# EAGLE schematic chaprshield (EAGLE 6.4)
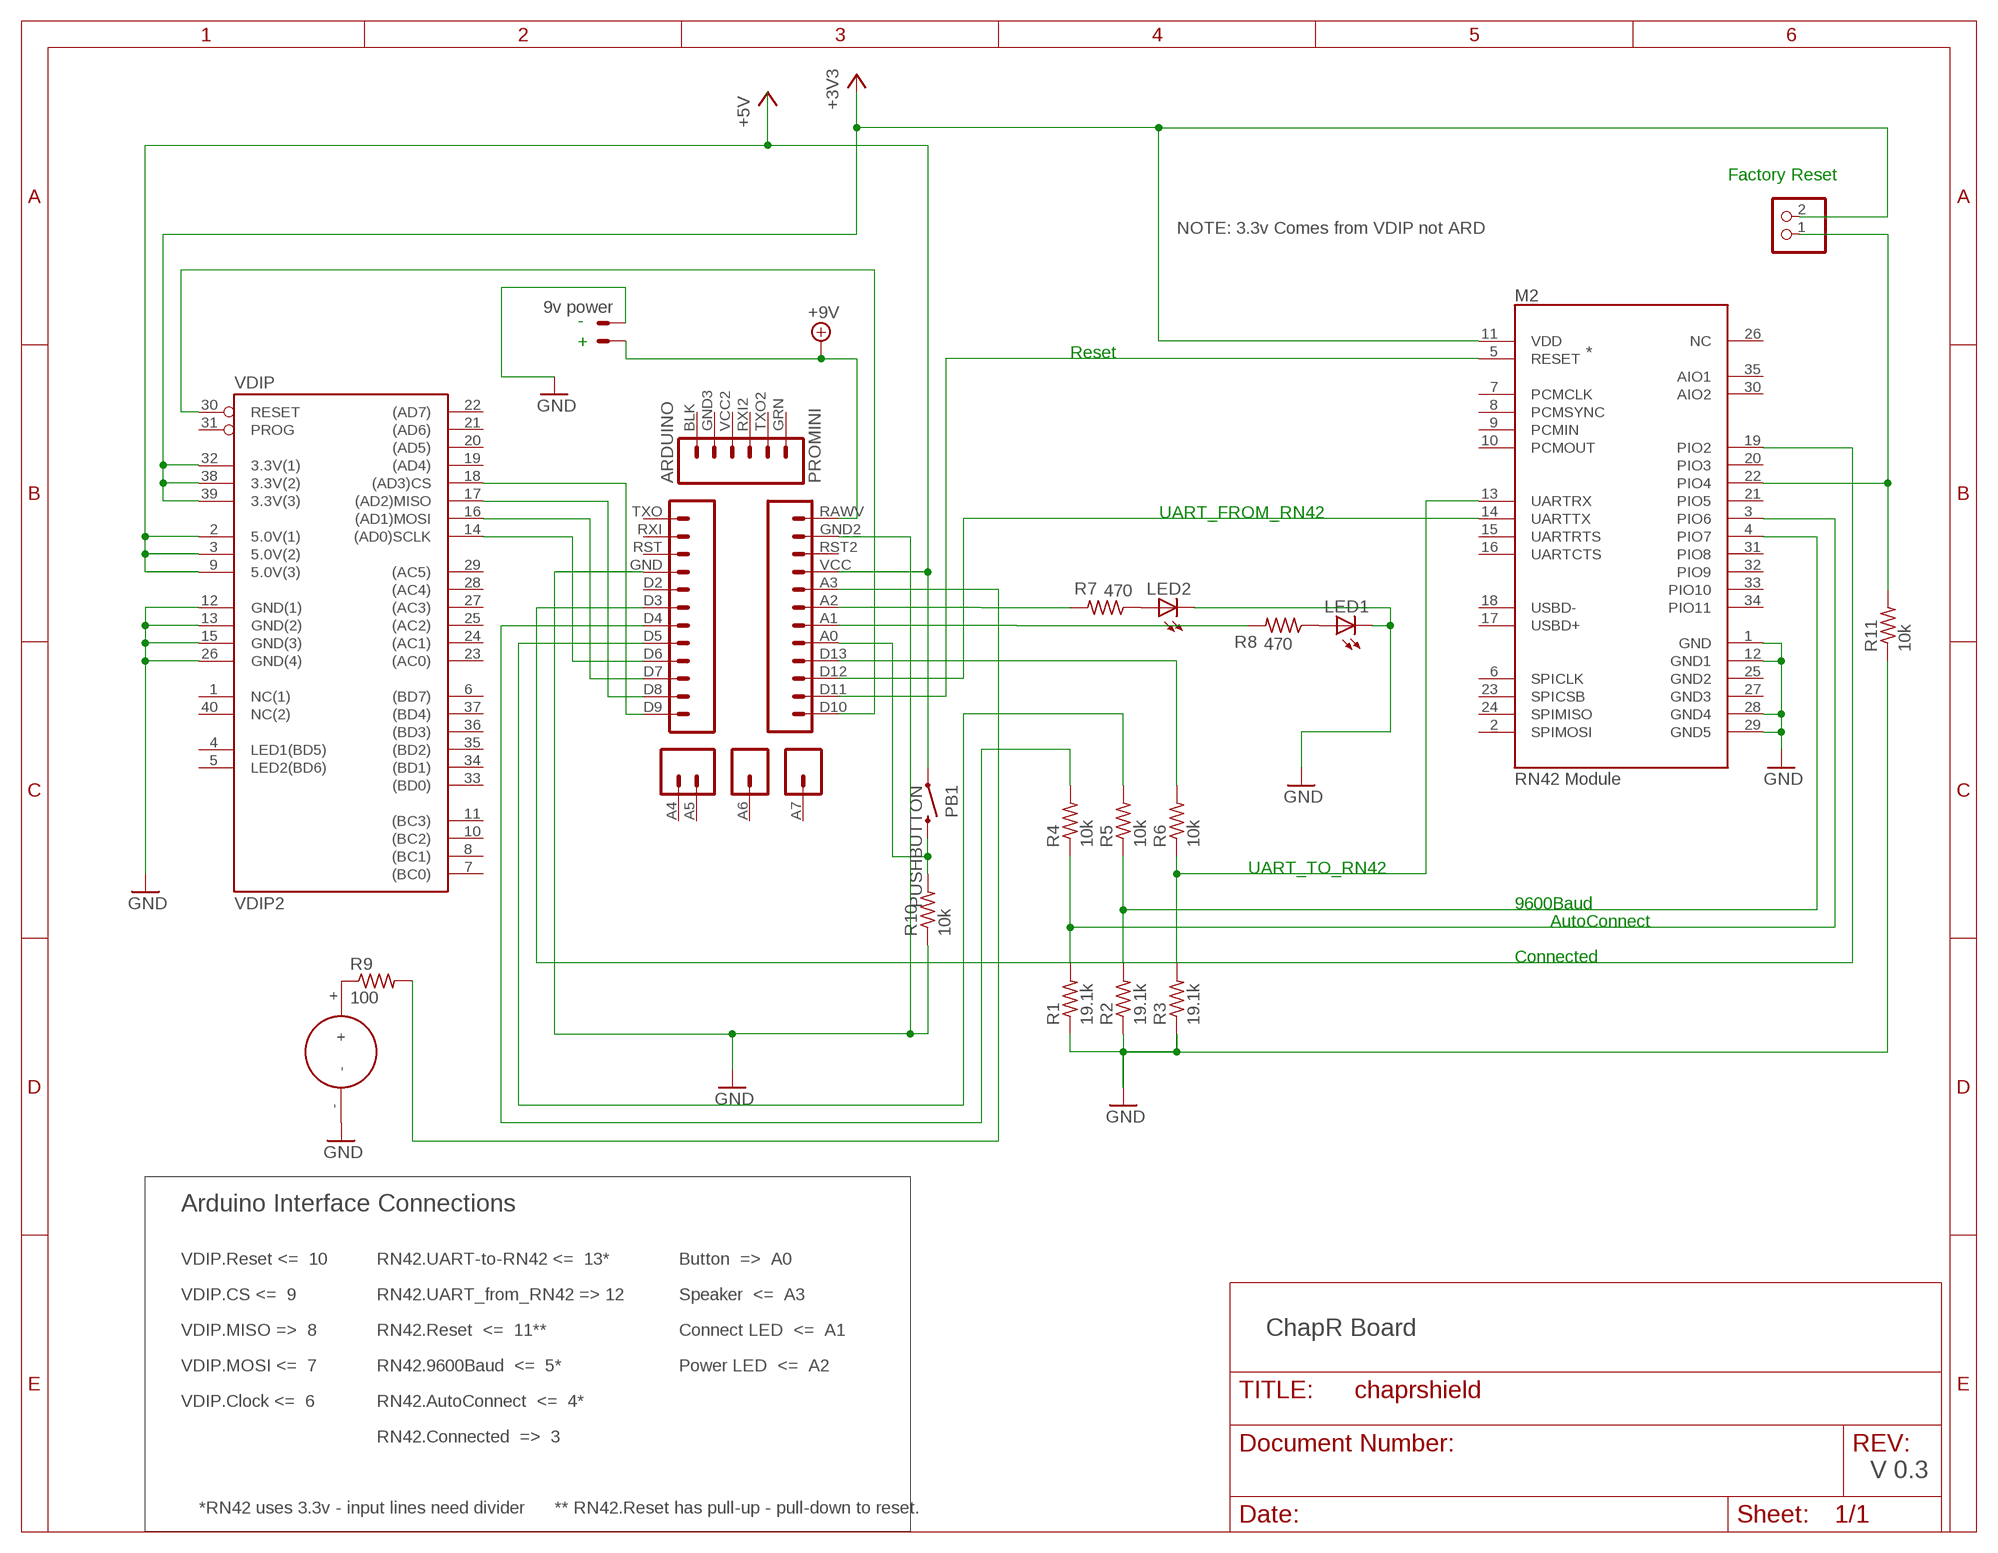
[diagram p0: schematic, sheet 1]

## Parts
-  9v power  22-23-2021  [22-23-2021]
ARDUINO  PROMINI  [PROMINI]
JP1  PINHD-1X2  [1X02]
LED1  LED3MM  [LED3MM]
LED2  LED3MM  [LED3MM]
M2  RN42 Module  BLUETOOTH-RN41"  [RN41]
PB1  PUSHBUTTON  [2-PIN-PUSHBUTTON]
R1  19.1k  R-US_0207/10  [0207/10]
R2  19.1k  R-US_0207/10  [0207/10]
R3  19.1k  R-US_0207/10  [0207/10]
R4  10k  R-US_0207/10  [0207/10]
R5  10k  R-US_0207/10  [0207/10]
R6  10k  R-US_0207/10  [0207/10]
R7  470  R-US_0207/10  [0207/10]
R8  470  R-US_0207/10  [0207/10]
R9  100  R-US_0207/10  [0207/10]
R10  10k  R-US_0207/10  [0207/10]
R11  10k  R-US_0207/10  [0207/10]
U$2  SPEAKER  [SPEAKER]
VDIP  VDIP2  [VDIP2]

## Nets
3.3V [GND]: JP1.2 M2.11(VDD) VDIP.32(3.3V(1)) VDIP.38(3.3V(2)) VDIP.39(3.3V(3))
+9V [GND]: -.2 ARDUINO.RAWV
GND [GND]: -.1 ARDUINO.GND ARDUINO.GND2 LED1.K(C) LED2.K(C) M2.1(GND) M2.12(GND1) M2.28(GND4) M2.29(GND5) R1.1 R2.1 R3.1 R10.1 R11.1 U$2.- VDIP.12(GND(1)) VDIP.13(GND(2)) VDIP.15(GND(3)) VDIP.26(GND(4))
N$1: ARDUINO.VCC PB1.P$1 VDIP.2(5.0V(1)) VDIP.3(5.0V(2)) VDIP.9(5.0V(3))
N$2: ARDUINO.D10 VDIP.30(RESET)
N$3: ARDUINO.D13 R6.2
N$4: ARDUINO.D12 M2.14(UARTTX)
N$5: ARDUINO.D11 M2.5(RESET)
N$6: M2.3(PIO6) R1.2 R4.1
N$7: M2.4(PIO7) R2.2 R5.1
N$8: ARDUINO.D5 R5.2
N$9: M2.13(UARTRX) R3.2 R6.1
N$10: ARDUINO.D9 VDIP.18((AD3)CS)
N$11: ARDUINO.D8 VDIP.17((AD2)MISO)
N$12: ARDUINO.D7 VDIP.16((AD1)MOSI)
N$13: ARDUINO.D6 VDIP.14((AD0)SCLK)
N$14: ARDUINO.D4 R4.2
N$15: ARDUINO.D3 M2.19(PIO2)
N$16: LED2.A R7.1
N$17: LED1.A R8.1
N$18: ARDUINO.A2 R7.2
N$19: R9.1 U$2.+
N$20: ARDUINO.A1 R8.2
N$21: ARDUINO.A3 R9.2
N$22: JP1.1 M2.22(PIO4) R11.2
N$24: ARDUINO.A0 PB1.P$2 R10.2
Unconnected: ARDUINO.A4 ARDUINO.A5 ARDUINO.A6 ARDUINO.A7 ARDUINO.BLK ARDUINO.D2 ARDUINO.GND3 ARDUINO.GRN ARDUINO.RST ARDUINO.RST2 ARDUINO.RXI ARDUINO.RXI2 ARDUINO.TXO ARDUINO.TXO2 ARDUINO.VCC2 M2.2(SPIMOSI) M2.6(SPICLK) M2.7(PCMCLK) M2.8(PCMSYNC) M2.9(PCMIN) M2.10(PCMOUT) M2.15(UARTRTS) M2.16(UARTCTS) M2.17(USBD+) M2.18(USBD-) M2.20(PIO3) M2.21(PIO5) M2.23(SPICSB) M2.24(SPIMISO) M2.25(GND2) M2.26(NC) M2.27(GND3) M2.30(AIO2) M2.31(PIO8) M2.32(PIO9) M2.33(PIO10) M2.34(PIO11) M2.35(AIO1) VDIP.6((BD7)) VDIP.7((BC0)) VDIP.8((BC1)) VDIP.10((BC2)) VDIP.11((BC3)) VDIP.19((AD4)) VDIP.20((AD5)) VDIP.21((AD6)) VDIP.22((AD7)) VDIP.23((AC0)) VDIP.24((AC1)) VDIP.25((AC2)) VDIP.27((AC3)) VDIP.28((AC4)) VDIP.29((AC5)) VDIP.31(PROG) VDIP.33((BD0)) VDIP.34((BD1)) VDIP.35((BD2)) VDIP.36((BD3)) VDIP.37((BD4))

## Notes on the sheet
- Factory Reset
- NOTE: 3.3v Comes from VDIP not ARD
- -
- +
- Reset | *
- UART_FROM_RN42
- UART_TO_RN42
- 9600Baud
- AutoConnect
- Connected
- Arduino Interface Connections
- VDIP.Reset <=  10 | RN42.UART-to-RN42 <=  13* | Button  =>  A0
- VDIP.CS <=  9 | RN42.UART_from_RN42 => 12 | Speaker  <=  A3
- VDIP.MISO =>  8 | RN42.Reset  <=  11** | Connect LED  <=  A1 | ChapR Board
- VDIP.MOSI <=  7 | RN42.9600Baud  <=  5* | Power LED  <=  A2
- VDIP.Clock <=  6 | RN42.AutoConnect  <=  4*
- RN42.Connected  =>  3
- V 0.3
- *RN42 uses 3.3v - input lines need divider | ** RN42.Reset has pull-up - pull-down to reset.

## Power pins joined to a net without a drawn wire
LED1(BD5): VDIP.4(LED1(BD5))
LED2(BD6): VDIP.5(LED2(BD6))
NC(1): VDIP.1(NC(1))
NC(2): VDIP.40(NC(2))

## Library data of the parts
- = con-molex:22-23-2021: .100" (2.54mm) Center Header - 2 Pin; MF: MOLEX; MPN: 22-23-2021; OC_FARNELL: 1462926; OC_NEWARK: 25C3832
ARDUINO = ChapR-Custom:PROMINI
JP1 = pinhead:PINHD-1X2: PIN HEADER
LED1 LED2 = led:LED: LED OSRAM: - CHIPLED LG R971, LG N971, LY N971, LG Q971, LY Q971, LO R971, LY R971 LH N974, LH R974 LS Q976, LO Q976, LY Q976 LO Q996 - Hyper CHIPLED LW Q18S LB Q993, LB Q99A, LB R99A - SideLED LS A670, LO A670, LY A670, LG A670, LP A670 LB A673, LV A673, LT A673, LW A673 LH A674 LY A675 LS A676, LA A676, LO A676, LY A676, LW A676 LS A679, LY A679, LG A679 - Hyper Micro SIDELED® LS Y876, LA Y876, LO Y876, LY Y876 LT Y87S - SmartLED LW L88C, LW L88S LB L89C, LB L89S, LG L890 LS L89K, LO L89K, LY L89K LS L896, LA L896, LO L896, LY L896 - TOPLED LS T670, LO T670, LY T670, LG T670, LP T670 LSG T670, LSP T670, LSY T670, LOP T670, LYG T670 LG T671, LOG T671, LSG T671 LB T673, LV T673, LT T673, LW T673 LH T674 LS T676, LA T676, LO T676, LY T676, LB T676, LH T676, LSB T676, LW T676 LB T67C, LV T67C, LT T67C, LS T67K, LO T67K, LY T67K, LW E67C LS E67B, LA E67B, LO E67B, LY E67B, LB E67C, LV E67C, LT E67C LW T67C LS T679, LY T679, LG T679 LS T770, LO T770, LY T770, LG T770, LP T770 LB T773, LV T773, LT T773, LW T773 LH T774 LS E675, LA E675, LY E675, LS T675 LS T776, LA T776, LO T776, LY T776, LB T776 LHGB T686 LT T68C, LB T68C - Hyper Mini TOPLED® LB M676 - Mini TOPLED Santana® LG M470 LS M47K, LO M47K, LY M47K Source: http://www.osram.convergy.de LUXEON: - LUMILED® LXK2-PW12-R00, LXK2-PW12-S00, LXK2-PW14-U00, LXK2-PW14-V00 LXK2-PM12-R00, LXK2-PM12-S00, LXK2-PM14-U00 LXK2-PE12-Q00, LXK2-PE12-R00, LXK2-PE12-S00, LXK2-PE14-T00, LXK2-PE14-U00 LXK2-PB12-K00, LXK2-PB12-L00, LXK2-PB12-M00, LXK2-PB14-N00, LXK2-PB14-P00, LXK2-PB14-Q00 LXK2-PR12-L00, LXK2-PR12-M00, LXK2-PR14-Q00, LXK2-PR14-R00 LXK2-PD12-Q00, LXK2-PD12-R00, LXK2-PD12-S00 LXK2-PH12-R00, LXK2-PH12-S00 LXK2-PL12-P00, LXK2-PL12-Q00, LXK2-PL12-R00 Source: www.luxeon.com KINGBRIGHT: KA-3528ASYC Source: www.kingbright.com
M2 = SparkFun-RF:BLUETOOTH-RN41: Bluetooth SMD module
PB1 = ChapR-Custom:PUSHBUTTON
R1-R11 = resistor:R-US_: RESISTOR, American symbol
U$2 = ChapR-Custom:SPEAKER
VDIP = ChapR-Custom:VDIP2

## Net classes
1 GND: width 0.635 mm